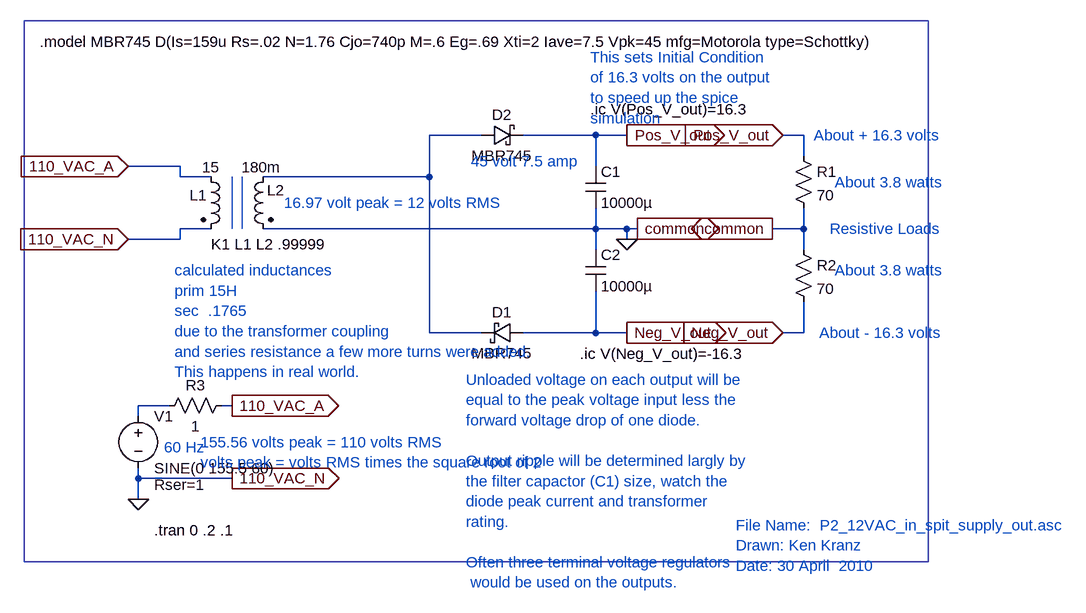
[diagram p0: schematic P2_12VAC_in_split_supply_out.asc]
P2_12VAC_in_split_supply_out.asc, the LTspice schematic file:
Version 4
SHEET 1 1796 680
WIRE 512 -16 432 -16
WIRE 688 -16 576 -16
WIRE 736 -16 688 -16
WIRE 1008 -16 976 -16
WIRE 1008 16 1008 -16
WIRE 48 32 -32 32
WIRE 688 32 688 -16
WIRE 48 48 48 32
WIRE 96 48 48 48
WIRE 432 48 432 -16
WIRE 432 48 176 48
WIRE 96 128 48 128
WIRE 688 128 688 96
WIRE 688 128 176 128
WIRE 736 128 688 128
WIRE 752 128 736 128
WIRE 1008 128 1008 96
WIRE 1008 128 960 128
WIRE 48 144 48 128
WIRE 48 144 -32 144
WIRE 736 144 736 128
WIRE 688 160 688 128
WIRE 1008 160 1008 128
WIRE 432 288 432 48
WIRE 512 288 432 288
WIRE 688 288 688 224
WIRE 688 288 576 288
WIRE 736 288 688 288
WIRE 1008 288 1008 240
WIRE 1008 288 976 288
WIRE 32 400 -16 400
WIRE 128 400 112 400
WIRE -16 416 -16 400
WIRE -16 512 -16 496
WIRE 128 512 -16 512
WIRE -16 544 -16 512
FLAG -32 32 110_VAC_A
IOPIN -32 32 In
FLAG -32 144 110_VAC_N
IOPIN -32 144 In
FLAG -16 544 0
FLAG 128 400 110_VAC_A
IOPIN 128 400 Out
FLAG 128 512 110_VAC_N
IOPIN 128 512 Out
FLAG 752 128 common
IOPIN 752 128 Out
FLAG 736 -16 Pos_V_out
IOPIN 736 -16 Out
FLAG 736 288 Neg_V_out
IOPIN 736 288 Out
FLAG 976 -16 Pos_V_out
IOPIN 976 -16 In
FLAG 976 288 Neg_V_out
IOPIN 976 288 In
FLAG 960 128 common
IOPIN 960 128 Out
FLAG 736 144 0
SYMBOL ind2 80 32 R0
WINDOW 0 -17 44 Left 0
WINDOW 3 2 1 Left 0
SYMATTR InstName L1
SYMATTR Value 15
SYMATTR Type ind
SYMATTR SpiceLine Rser=0
SYMBOL ind2 192 32 M0
WINDOW 0 -17 37 Left 0
WINDOW 3 -12 1 Left 0
SYMATTR InstName L2
SYMATTR Value 180m
SYMATTR Type ind
SYMATTR SpiceLine Rser=1m
SYMBOL cap 672 32 R0
SYMATTR InstName C1
SYMATTR Value 10000µ
SYMBOL voltage -16 400 R0
WINDOW 123 0 0 Left 0
WINDOW 39 24 122 Left 0
SYMATTR SpiceLine Rser=1
SYMATTR InstName V1
SYMATTR Value SINE(0 155.5 60)
SYMBOL res 992 0 R0
SYMATTR InstName R1
SYMATTR Value 70
SYMBOL cap 672 160 R0
SYMATTR InstName C2
SYMATTR Value 10000µ
SYMBOL res 992 144 R0
SYMATTR InstName R2
SYMATTR Value 70
SYMBOL res 128 384 R90
WINDOW 0 0 56 VBottom 0
WINDOW 3 32 56 VTop 0
SYMATTR InstName R3
SYMATTR Value 1
SYMBOL schottky 512 0 R270
WINDOW 0 32 32 VTop 0
WINDOW 3 0 32 VBottom 0
SYMATTR InstName D2
SYMATTR Value MBR745
SYMATTR Description Diode
SYMATTR Type diode
SYMBOL schottky 576 272 R90
WINDOW 0 0 32 VBottom 0
WINDOW 3 32 32 VTop 0
SYMATTR InstName D1
SYMATTR Value MBR745
SYMATTR Description Diode
SYMATTR Type diode
TEXT 8 592 Left 0 !.tran 0 .2 .1
TEXT 96 152 Left 0 !K1 L1 L2 .99999
TEXT 80 456 Left 0 ;155.56 volts peak = 110 volts RMS\nvolts peak = volts RMS times the square root of 2
TEXT 24 464 Left 0 ;60 Hz
TEXT 208 88 Left 0 ;16.97 volt peak = 12 volts RMS
TEXT 1048 128 Left 0 ;Resistive Loads
TEXT 488 360 Left 0 ;Unloaded voltage on each output will be\nequal to the peak voltage input less the \nforward voltage drop of one diode.\n \nOutput ripple will be determined largly by\nthe filter capactor (C1) size, watch the \ndiode peak current and transformer\nrating.\n \nOften three terminal voltage regulators\n would be used on the outputs.
TEXT 680 -56 Left 0 !.ic V(Pos_V_out)=16.3
TEXT 1024 -16 Left 0 ;About + 16.3 volts
TEXT 40 192 Left 0 ;calculated inductances\nprim 15H \nsec  .1765\ndue to the transformer coupling\nand series resistance a few more turns were added.\nThis happens in real world.
TEXT 680 -136 Left 0 ;This sets Initial Condition\nof 16.3 volts on the output\nto speed up the spice\nsimulation
TEXT 664 320 Left 0 !.ic V(Neg_V_out)=-16.3
TEXT 1032 288 Left 0 ;About - 16.3 volts
TEXT 1056 56 Left 0 ;About 3.8 watts
TEXT 1056 192 Left 0 ;About 3.8 watts
TEXT 904 584 Left 0 ;File Name:  P2_12VAC_in_spit_supply_out.asc\nDrawn: Ken Kranz\nDate: 30 April  2010
TEXT -168 -160 Left 0 !.model MBR745 D(Is=159u Rs=.02 N=1.76 Cjo=740p M=.6 Eg=.69 Xti=2 Iave=7.5 Vpk=45 mfg=Motorola type=Schottky)
TEXT 496 24 Left 0 ;45 volt 7.5 amp
LINE Normal 128 128 128 48
LINE Normal 144 128 144 48
RECTANGLE Normal 1200 640 -192 -192

The netlist it stands for:
* P2_12VAC_in_split_supply_out.asc
L1 110_VAC_A 0 15 Rser=0
L2 N001 0 180m Rser=1m
C1 Pos_V_out 0 10000µ
V1 N002 0 SINE(0 155.5 60) Rser=1
R1 Pos_V_out 0 70
C2 0 Neg_V_out 10000µ
R2 0 Neg_V_out 70
R3 110_VAC_A N002 1
D2 N001 Pos_V_out MBR745
D1 Neg_V_out N001 MBR745
.model D D
.lib standard.dio
.tran 0 .2 .1
K1 L1 L2 .99999
* 155.56 volts peak = 110 volts RMS
* volts peak = volts RMS times the square root of 2
* 60 Hz
* 16.97 volt peak = 12 volts RMS
* Resistive Loads
* Unloaded voltage on each output will be
* equal to the peak voltage input less the
* forward voltage drop of one diode.
* Output ripple will be determined largly by
* the filter capactor (C1) size, watch the
* diode peak current and transformer
* rating.
* Often three terminal voltage regulators
*  would be used on the outputs.
.ic V(Pos_V_out)=16.3
* About + 16.3 volts
* calculated inductances
* prim 15H
* sec  .1765
* due to the transformer coupling
* and series resistance a few more turns were added.
* This happens in real world.
* This sets Initial Condition
* of 16.3 volts on the output
* to speed up the spice
* simulation
.ic V(Neg_V_out)=-16.3
* About - 16.3 volts
* About 3.8 watts
* About 3.8 watts
* File Name:  P2_12VAC_in_spit_supply_out.asc
* Drawn: Ken Kranz
* Date: 30 April  2010
.model MBR745 D(Is=159u Rs=.02 N=1.76 Cjo=740p M=.6 Eg=.69 Xti=2 Iave=7.5 Vpk=45 mfg=Motorola type=Schottky)
* 45 volt 7.5 amp
.backanno
.end